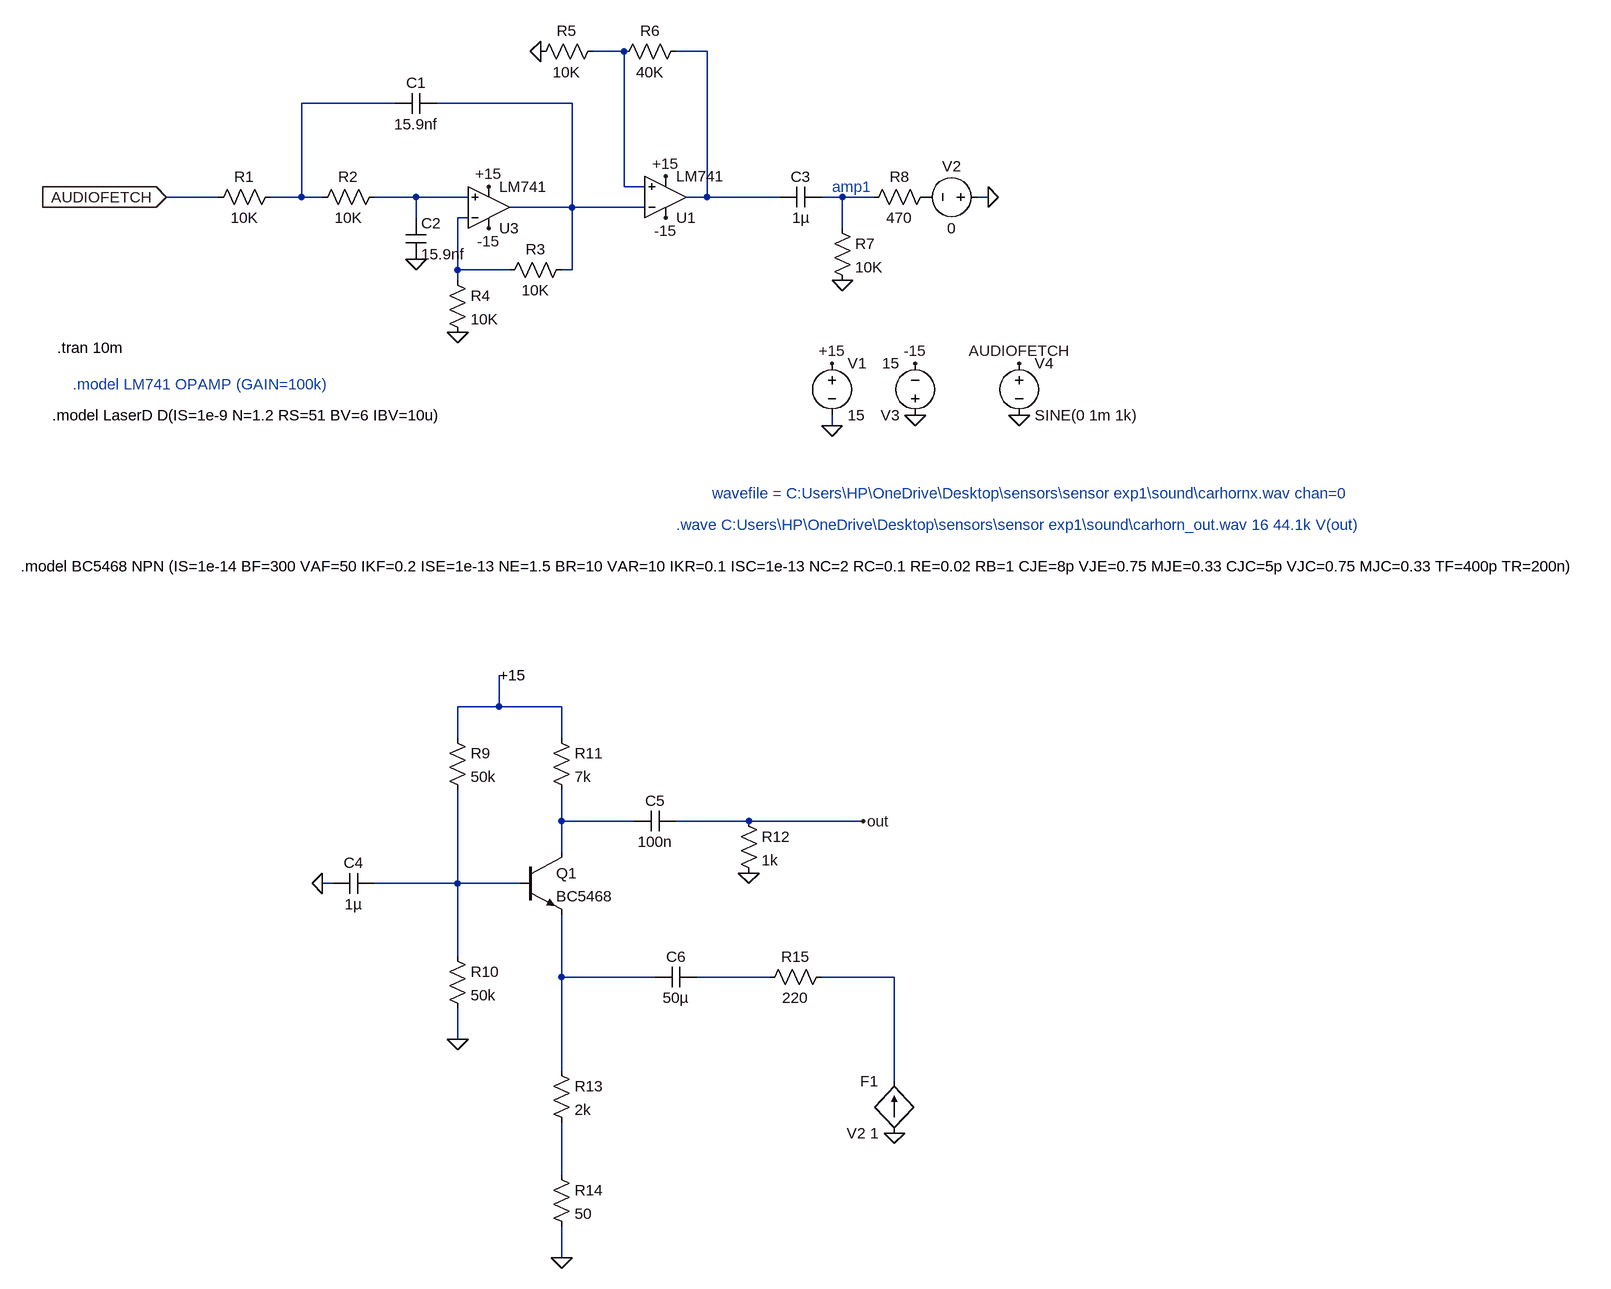
[diagram p0: schematic PROJECT DIDI.asc]
PROJECT DIDI.asc, the LTspice schematic file:
Version 4
SHEET 1 2752 1604
WIRE 784 -272 736 -272
WIRE 912 -272 864 -272
WIRE 432 -192 288 -192
WIRE 704 -192 496 -192
WIRE 784 -64 784 -272
WIRE 816 -64 784 -64
WIRE 160 -48 80 -48
WIRE 288 -48 288 -192
WIRE 288 -48 240 -48
WIRE 320 -48 288 -48
WIRE 464 -48 400 -48
WIRE 544 -48 464 -48
WIRE 912 -48 912 -272
WIRE 912 -48 880 -48
WIRE 1024 -48 912 -48
WIRE 1120 -48 1088 -48
WIRE 1168 -48 1120 -48
WIRE 1344 -48 1328 -48
WIRE 704 -32 704 -192
WIRE 704 -32 608 -32
WIRE 816 -32 704 -32
WIRE 464 -16 464 -48
WIRE 544 -16 528 -16
WIRE 1120 0 1120 -48
WIRE 528 64 528 -16
WIRE 608 64 528 64
WIRE 704 64 704 -32
WIRE 704 64 688 64
WIRE 528 80 528 64
WIRE 1104 304 1104 288
WIRE 592 736 592 688
WIRE 592 736 528 736
WIRE 688 736 592 736
WIRE 528 784 528 736
WIRE 688 784 688 736
WIRE 688 912 688 864
WIRE 800 912 688 912
WIRE 976 912 864 912
WIRE 1152 912 976 912
WIRE 688 960 688 912
WIRE 336 1008 320 1008
WIRE 528 1008 528 864
WIRE 528 1008 400 1008
WIRE 624 1008 528 1008
WIRE 528 1120 528 1008
WIRE 688 1152 688 1056
WIRE 832 1152 688 1152
WIRE 1008 1152 896 1152
WIRE 1200 1152 1088 1152
WIRE 528 1248 528 1200
WIRE 688 1296 688 1152
WIRE 1200 1312 1200 1152
WIRE 688 1456 688 1376
WIRE 688 1584 688 1536
FLAG 464 48 0
FLAG 528 160 0
FLAG 1344 -48 0
FLAG 80 -48 AUDIOFETCH
IOPIN 80 -48 In
FLAG 1120 80 0
FLAG 1104 304 0
FLAG 1104 208 +15
FLAG 1232 288 0
FLAG 1232 208 -15
FLAG 576 -64 +15
FLAG 576 0 -15
FLAG 848 -80 +15
FLAG 848 -16 -15
FLAG 1392 288 0
FLAG 1392 208 AUDIOFETCH
FLAG 688 1584 0
FLAG 976 992 0
FLAG 1200 1392 0
FLAG 528 1248 0
FLAG 320 1008 0
FLAG 1152 912 out
FLAG 656 -272 0
SYMBOL res 256 -64 R90
WINDOW 0 0 56 VBottom 2
WINDOW 3 32 56 VTop 2
SYMATTR InstName R1
SYMATTR Value 10K
SYMBOL res 416 -64 R90
WINDOW 0 0 56 VBottom 2
WINDOW 3 32 56 VTop 2
SYMATTR InstName R2
SYMATTR Value 10K
SYMBOL cap 496 -208 R90
WINDOW 0 0 32 VBottom 2
WINDOW 3 32 32 VTop 2
SYMATTR InstName C1
SYMATTR Value 15.9nf
SYMBOL cap 448 -16 R0
SYMATTR InstName C2
SYMATTR Value 15.9nf
SYMBOL res 704 48 R90
WINDOW 0 0 56 VBottom 2
WINDOW 3 32 56 VTop 2
SYMATTR InstName R3
SYMATTR Value 10K
SYMBOL res 512 64 R0
SYMATTR InstName R4
SYMATTR Value 10K
SYMBOL res 752 -288 R90
WINDOW 0 0 56 VBottom 2
WINDOW 3 32 56 VTop 2
SYMATTR InstName R5
SYMATTR Value 10K
SYMBOL res 880 -288 R90
WINDOW 0 0 56 VBottom 2
WINDOW 3 32 56 VTop 2
SYMATTR InstName R6
SYMATTR Value 40K
SYMBOL cap 1088 -64 R90
WINDOW 0 0 32 VBottom 2
WINDOW 3 32 32 VTop 2
SYMATTR InstName C3
SYMATTR Value 1µ
SYMBOL res 1104 -16 R0
SYMATTR InstName R7
SYMATTR Value 10K
SYMBOL res 1264 -64 R90
WINDOW 0 0 56 VBottom 2
WINDOW 3 32 56 VTop 2
SYMATTR InstName R8
SYMATTR Value 470
SYMBOL voltage 1344 -48 R90
WINDOW 0 -32 56 VBottom 2
WINDOW 3 32 56 VTop 2
SYMATTR InstName V2
SYMATTR Value 0
SYMBOL voltage 1104 192 R0
WINDOW 123 0 0 Left 0
WINDOW 39 0 0 Left 0
SYMATTR InstName V1
SYMATTR Value 15
SYMBOL voltage 1232 304 R180
WINDOW 123 0 0 Left 0
WINDOW 39 0 0 Left 0
SYMATTR InstName V3
SYMATTR Value 15
SYMBOL LM741 576 32 M180
SYMATTR InstName U3
SYMBOL LM741 848 16 M180
SYMATTR InstName U1
SYMBOL voltage 1392 192 R0
WINDOW 123 0 0 Left 0
WINDOW 39 0 0 Left 0
SYMATTR InstName V4
SYMATTR Value SINE(0 1m 1k)
SYMBOL npn 624 960 R0
SYMATTR InstName Q1
SYMATTR Value BC5468
SYMBOL cap 400 992 R90
WINDOW 0 0 32 VBottom 2
WINDOW 3 32 32 VTop 2
SYMATTR InstName C4
SYMATTR Value 1µ
SYMBOL res 512 768 R0
SYMATTR InstName R9
SYMATTR Value 50k
SYMBOL res 512 1104 R0
SYMATTR InstName R10
SYMATTR Value 50k
SYMBOL res 672 768 R0
SYMATTR InstName R11
SYMATTR Value 7k
SYMBOL cap 864 896 R90
WINDOW 0 0 32 VBottom 2
WINDOW 3 32 32 VTop 2
SYMATTR InstName C5
SYMATTR Value 100n
SYMBOL res 960 896 R0
SYMATTR InstName R12
SYMATTR Value 1k
SYMBOL res 672 1280 R0
SYMATTR InstName R13
SYMATTR Value 2k
SYMBOL res 672 1440 R0
SYMATTR InstName R14
SYMATTR Value 50
SYMBOL cap 896 1136 R90
WINDOW 0 0 32 VBottom 2
WINDOW 3 32 32 VTop 2
SYMATTR InstName C6
SYMATTR Value 50µ
SYMBOL res 1104 1136 R90
WINDOW 0 0 56 VBottom 2
WINDOW 3 32 56 VTop 2
SYMATTR InstName R15
SYMATTR Value 220
SYMBOL f 1200 1392 R180
WINDOW 0 24 80 Left 2
WINDOW 3 24 0 Left 2
SYMATTR InstName F1
SYMATTR Value V2 1
TEXT -88 184 Left 2 !.tran 10m
TEXT -64 240 Left 2 ;.model LM741 OPAMP (GAIN=100k)
TEXT 1104 -64 Left 2 ;amp1
TEXT -96 288 Left 2 !.model LaserD D(IS=1e-9 N=1.2 RS=51 BV=6 IBV=10u)
TEXT 920 408 Left 2 ;wavefile = C:Users\\HP\\OneDrive\\Desktop\\sensors\\sensor exp1\\sound\\carhornx.wav chan=0
TEXT 864 456 Left 2 ;.wave C:Users\\HP\\OneDrive\\Desktop\\sensors\\sensor exp1\\sound\\carhorn_out.wav 16 44.1k V(out)
TEXT 592 688 Left 2 !+15
TEXT -144 520 Left 2 !.model BC5468 NPN (IS=1e-14 BF=300 VAF=50 IKF=0.2 ISE=1e-13 NE=1.5 BR=10 VAR=10 IKR=0.1 ISC=1e-13 NC=2 RC=0.1 RE=0.02 RB=1 CJE=8p VJE=0.75 MJE=0.33 CJC=5p VJC=0.75 MJC=0.33 TF=400p TR=200n)

The netlist it stands for:
* PROJECT DIDI.asc
R1 N003 AUDIOFETCH 10K
R2 N005 N003 10K
C1 N004 N003 15.9nf
C2 N005 0 15.9nf
R3 N004 N007 10K
R4 N007 0 10K
R5 N001 0 10K
R6 N002 N001 40K
C3 N006 N002 1µ
R7 N006 0 10K
R8 P001 N006 470
V2 0 P001 0
V1 +15 0 15
V3 0 -15 15
XU3 N005 N007 -15 +15 N004 LM741  ; pins In+ In- V+ V- OUT
XU1 N001 N004 -15 +15 N002 LM741  ; pins In+ In- V+ V- OUT
V4 AUDIOFETCH 0 SINE(0 1m 1k)
Q1 N009 N010 N011 0 BC5468
C4 N010 0 1µ
R9 N008 N010 50k
R10 N010 0 50k
R11 N008 N009 7k
C5 out N009 100n
R12 out 0 1k
R13 N011 N014 2k
R14 N014 0 50
C6 N012 N011 50µ
R15 N013 N012 220
F1 0 N013 V2 1
.model NPN NPN
.model PNP PNP
.lib standard.bjt
.tran 10m
* .model LM741 OPAMP (GAIN=100k)
* amp1
.model LaserD D(IS=1e-9 N=1.2 RS=51 BV=6 IBV=10u)
* wavefile = C:Users\HP\OneDrive\Desktop\sensors\sensor exp1\sound\carhornx.wav chan=0
* .wave C:Users\HP\OneDrive\Desktop\sensors\sensor exp1\sound\carhorn_out.wav 16 44.1k V(out)
+15
.model BC5468 NPN (IS=1e-14 BF=300 VAF=50 IKF=0.2 ISE=1e-13 NE=1.5 BR=10 VAR=10 IKR=0.1 ISC=1e-13 NC=2 RC=0.1 RE=0.02 RB=1 CJE=8p VJE=0.75 MJE=0.33 CJC=5p VJC=0.75 MJC=0.33 TF=400p TR=200n)
.lib LM741.lib
.backanno
.end